# EAGLE schematic boardv2temperature (EAGLE 6.6.0)
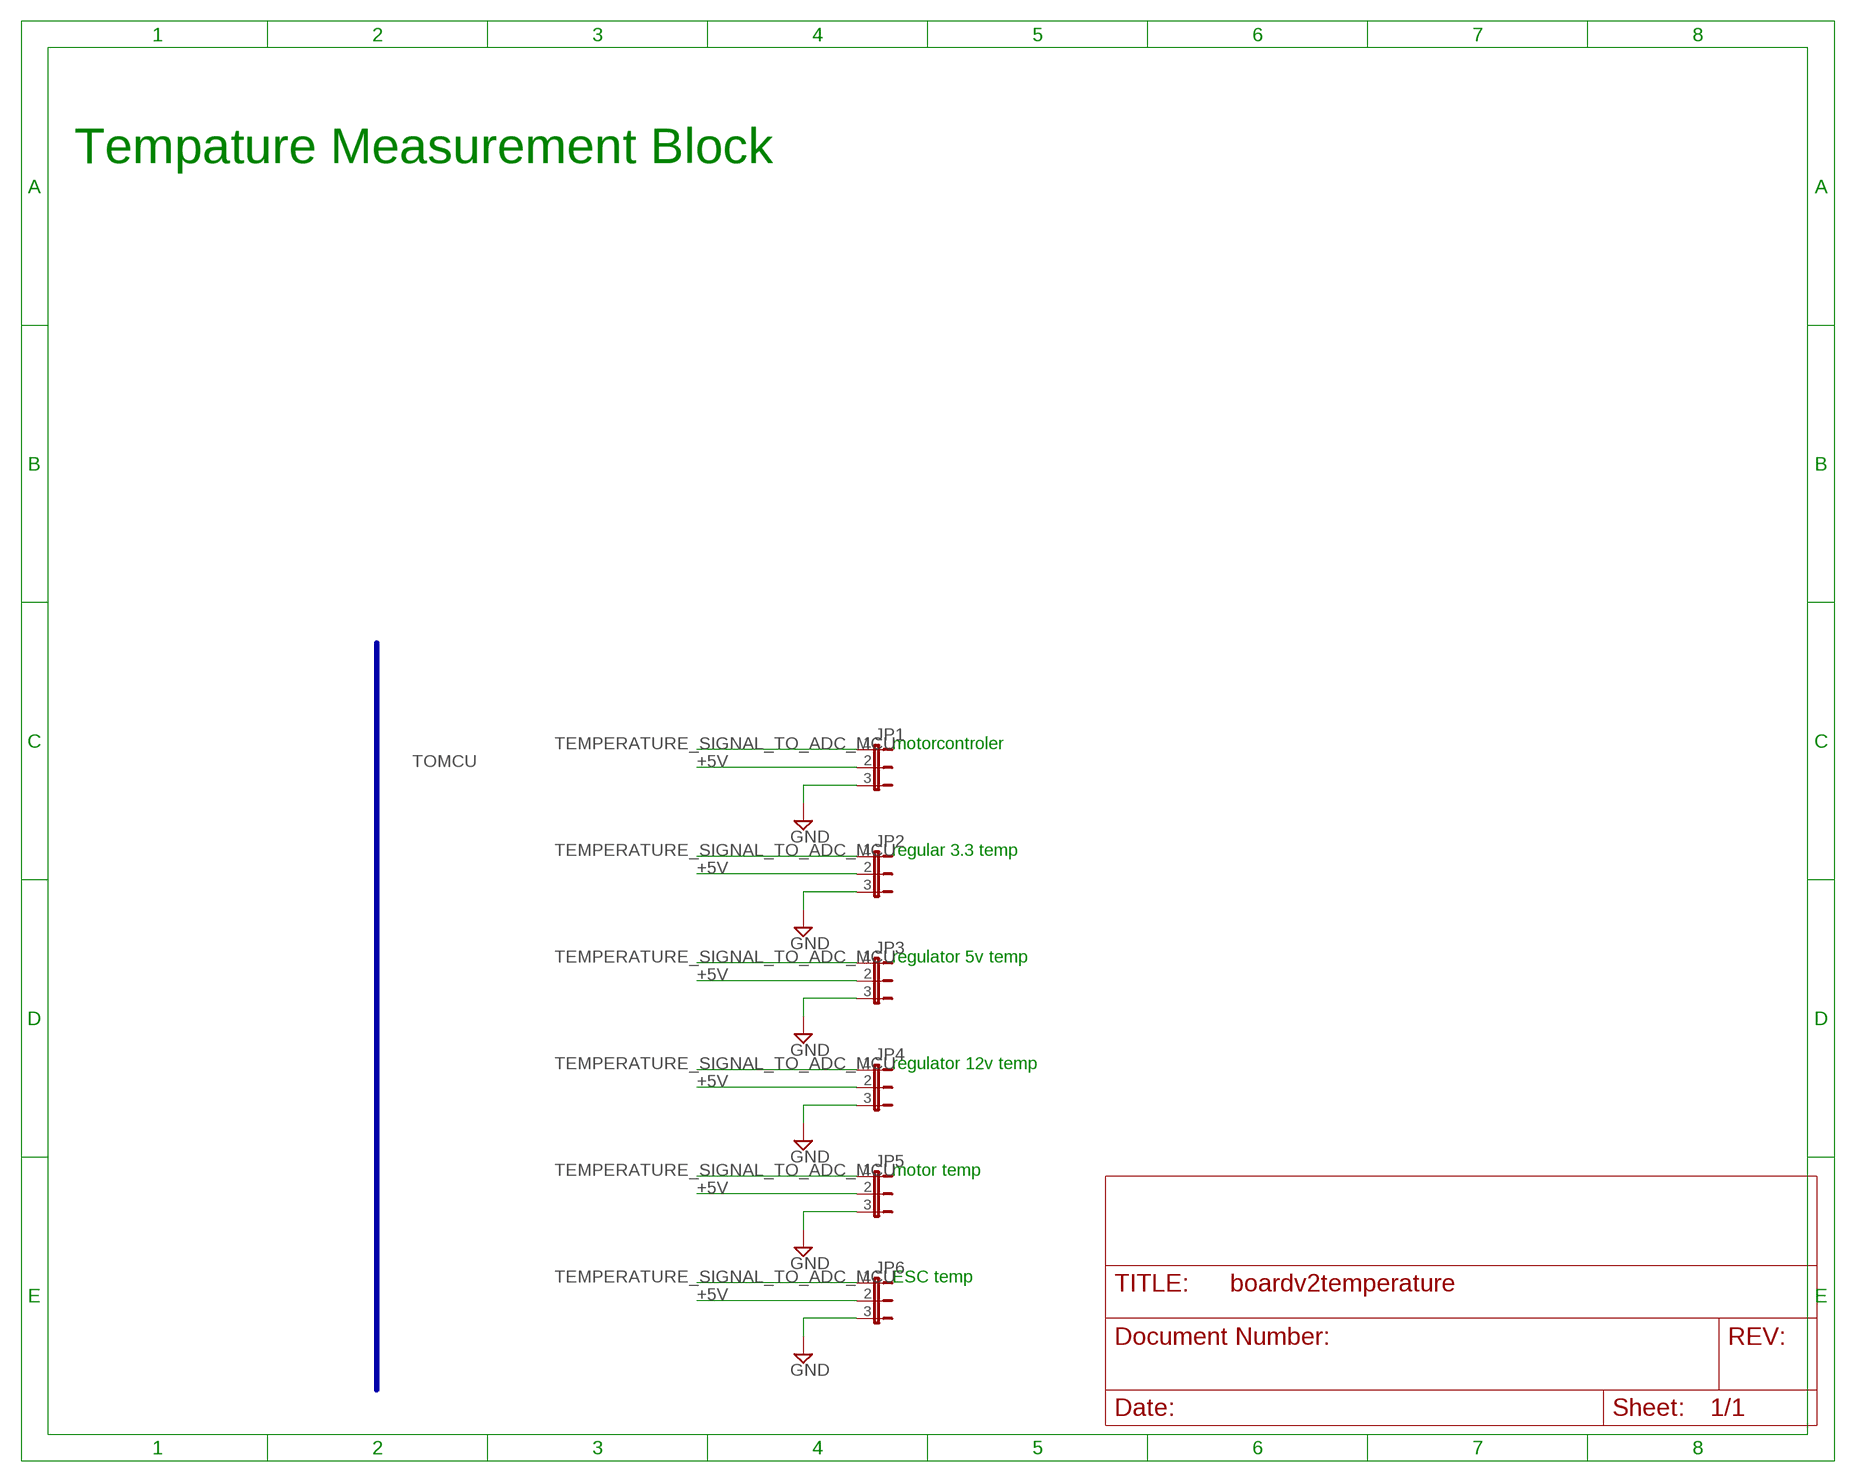
[diagram p0: schematic, sheet 1]

## Parts
JP1  JP2E  [JP2]
JP2  JP2E  [JP2]
JP3  JP2E  [JP2]
JP4  JP2E  [JP2]
JP5  JP2E  [JP2]
JP6  JP2E  [JP2]

## Nets
+5V: JP1.2 JP2.2 JP3.2 JP4.2 JP5.2 JP6.2
GND: JP1.3 JP2.3 JP3.3 JP4.3 JP5.3 JP6.3
TEMPERATURE_SIGNAL_TO_ADC_MCU: JP1.1 JP2.1 JP3.1 JP4.1 JP5.1 JP6.1

## Buses
TOMCU

## Notes on the sheet
- Tempature Measurement Block
- motorcontroler
- regular 3.3 temp
- regulator 5v temp
- regulator 12v temp
- motor temp
- ESC temp

## Library data of the parts
JP1-JP6 = jumper:JP2E: JUMPER